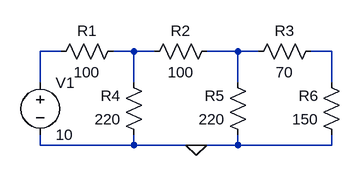
[diagram p0: schematic Draft1.asc]
Draft1.asc, the LTspice schematic file:
Version 4
SHEET 1 880 680
WIRE -64 64 -96 64
WIRE 48 64 16 64
WIRE 80 64 48 64
WIRE 208 64 160 64
WIRE 240 64 208 64
WIRE 352 64 320 64
WIRE -96 112 -96 64
WIRE 48 112 48 64
WIRE 208 112 208 64
WIRE 352 112 352 64
WIRE -96 208 -96 192
WIRE 48 208 48 192
WIRE 48 208 -96 208
WIRE 144 208 48 208
WIRE 208 208 208 192
WIRE 208 208 144 208
WIRE 352 208 352 192
WIRE 352 208 208 208
FLAG 144 208 0
SYMBOL res 32 48 R90
WINDOW 0 0 56 VBottom 2
WINDOW 3 32 56 VTop 2
SYMATTR InstName R1
SYMATTR Value 100
SYMBOL res 176 48 R90
WINDOW 0 0 56 VBottom 2
WINDOW 3 32 56 VTop 2
SYMATTR InstName R2
SYMATTR Value 100
SYMBOL res 336 48 R90
WINDOW 0 0 56 VBottom 2
WINDOW 3 32 56 VTop 2
SYMATTR InstName R3
SYMATTR Value 70
SYMBOL res 64 208 R180
WINDOW 0 36 76 Left 2
WINDOW 3 36 40 Left 2
SYMATTR InstName R4
SYMATTR Value 220
SYMBOL res 224 208 R180
WINDOW 0 36 76 Left 2
WINDOW 3 36 40 Left 2
SYMATTR InstName R5
SYMATTR Value 220
SYMBOL res 368 208 R180
WINDOW 0 36 76 Left 2
WINDOW 3 36 40 Left 2
SYMATTR InstName R6
SYMATTR Value 150
SYMBOL voltage -96 96 R0
WINDOW 123 0 0 Left 0
WINDOW 39 0 0 Left 0
SYMATTR InstName V1
SYMATTR Value 10

The netlist it stands for:
* Draft1.asc
R1 N002 N001 100
R2 N003 N002 100
R3 N004 N003 70
R4 0 N002 220
R5 0 N003 220
R6 0 N004 150
V1 N001 0 10
.backanno
.end